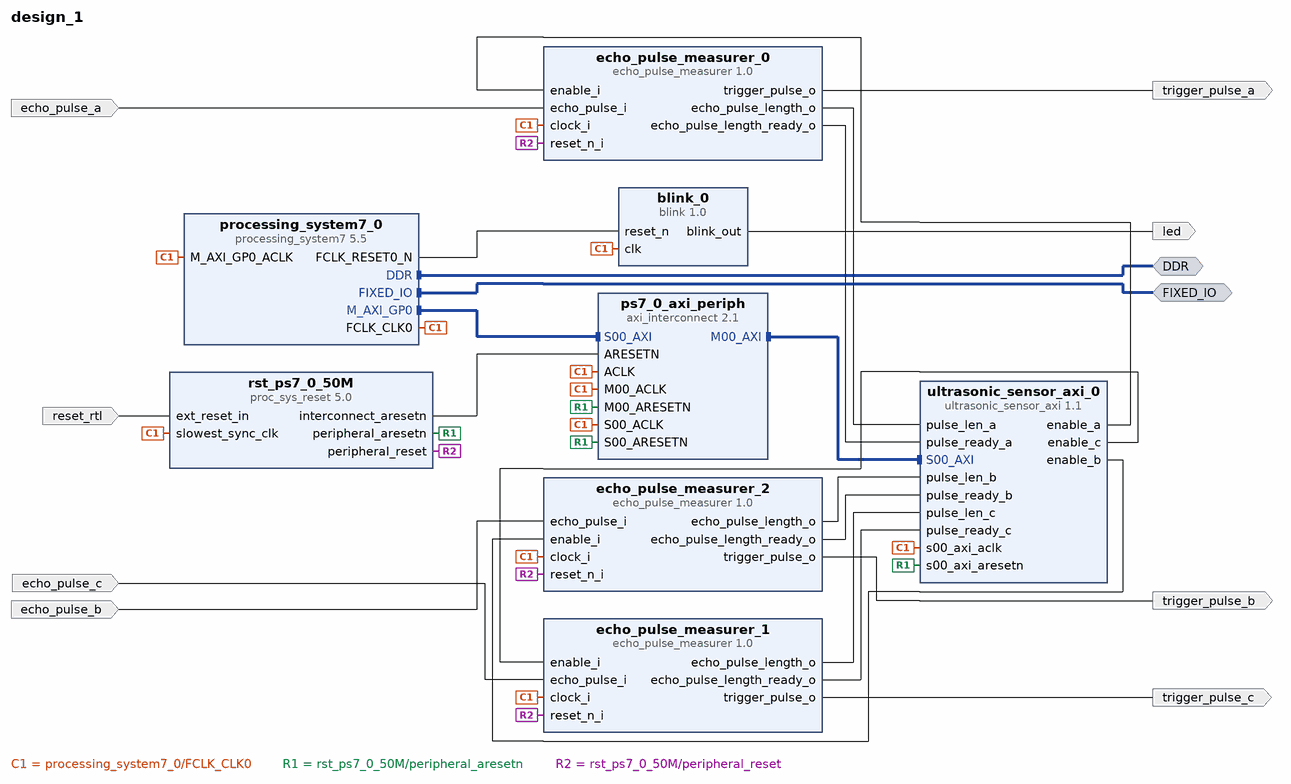
[diagram p0: block diagram of the top level]
# Vivado block design design_1, xc7z010clg400-1, Vivado 2017.2
create_bd_design design_1

create_bd_intf_port -mode Master -vlnv xilinx.com:interface:ddrx_rtl:1.0 DDR
create_bd_intf_port -mode Master -vlnv xilinx.com:display_processing_system7:fixedio_rtl:1.0 FIXED_IO
create_bd_port -dir O led
create_bd_port -dir I echo_pulse_a
create_bd_port -dir O trigger_pulse_a
create_bd_port -dir O trigger_pulse_b
create_bd_port -dir O trigger_pulse_c
create_bd_port -dir I echo_pulse_b
create_bd_port -dir I echo_pulse_c
create_bd_port -dir I -type rst reset_rtl
set_property -dict {CONFIG.POLARITY ACTIVE_LOW} [get_bd_ports reset_rtl]

create_bd_cell -type ip -vlnv xilinx.com:ip:processing_system7:5.5 processing_system7_0
set_property -dict [list \
  CONFIG.PCW_UIPARAM_DDR_FREQ_MHZ 400 \
  CONFIG.PCW_APU_PERIPHERAL_FREQMHZ 667 \
  CONFIG.PCW_QSPI_PERIPHERAL_FREQMHZ 200.000000 \
  CONFIG.PCW_SDIO_PERIPHERAL_FREQMHZ 100 \
  CONFIG.PCW_UART_PERIPHERAL_FREQMHZ 50 \
  CONFIG.PCW_FPGA0_PERIPHERAL_FREQMHZ 50 \
  CONFIG.PCW_FPGA1_PERIPHERAL_FREQMHZ 10 \
  CONFIG.PCW_FPGA2_PERIPHERAL_FREQMHZ 10 \
  CONFIG.PCW_FPGA3_PERIPHERAL_FREQMHZ 10 \
  CONFIG.PCW_PRESET_BANK0_VOLTAGE {LVCMOS 1.8V} \
  CONFIG.PCW_PRESET_BANK1_VOLTAGE {LVCMOS 1.8V} \
  CONFIG.PCW_UIPARAM_DDR_MEMORY_TYPE {LPDDR 2} \
  CONFIG.PCW_UIPARAM_DDR_PARTNO Custom \
  CONFIG.PCW_QSPI_PERIPHERAL_ENABLE 1 \
  CONFIG.PCW_QSPI_GRP_SINGLE_SS_ENABLE 1 \
  CONFIG.PCW_QSPI_GRP_SINGLE_SS_IO {MIO 1 .. 6} \
  CONFIG.PCW_QSPI_GRP_FBCLK_ENABLE 1 \
  CONFIG.PCW_SD0_PERIPHERAL_ENABLE 1 \
  CONFIG.PCW_SD0_SD0_IO {MIO 40 .. 45} \
  CONFIG.PCW_SD1_PERIPHERAL_ENABLE 1 \
  CONFIG.PCW_SD1_SD1_IO {MIO 10 .. 15} \
  CONFIG.PCW_UART0_PERIPHERAL_ENABLE 1 \
  CONFIG.PCW_UART0_UART0_IO {MIO 50 .. 51} \
  CONFIG.PCW_SPI1_PERIPHERAL_ENABLE 1 \
  CONFIG.PCW_SPI1_SPI1_IO {MIO 46 .. 51} \
  CONFIG.PCW_USB_RESET_ENABLE 1 \
  CONFIG.PCW_I2C_RESET_ENABLE 1 \
  CONFIG.PCW_GPIO_PERIPHERAL_ENABLE 1 \
  CONFIG.PCW_GPIO_MIO_GPIO_ENABLE 1 \
  CONFIG.PCW_GPIO_MIO_GPIO_IO MIO \
  CONFIG.PCW_GPIO_EMIO_GPIO_ENABLE 1 \
  CONFIG.PCW_GPIO_EMIO_GPIO_IO 64 \
] [get_bd_cells processing_system7_0]
# 156 more settings of processing_system7_0 are not shown: defaults, MIO pin electricals, DDR timing, and values the tool derives
create_bd_cell -type ip -vlnv craftdrones:user:blink:1.0 blink_0
set_property -dict {CONFIG.max_count 50000000} [get_bd_cells blink_0]
create_bd_cell -type ip -vlnv rit.edu:user:ultrasonic_sensor_axi:1.1 ultrasonic_sensor_axi_0
create_bd_cell -type ip -vlnv xilinx.com:ip:axi_interconnect:2.1 ps7_0_axi_periph
set_property -dict {CONFIG.NUM_MI 1} [get_bd_cells ps7_0_axi_periph]
create_bd_cell -type ip -vlnv xilinx.com:ip:proc_sys_reset:5.0 rst_ps7_0_50M
create_bd_cell -type ip -vlnv rit.edu:user:echo_pulse_measurer:1.0 echo_pulse_measurer_0
create_bd_cell -type ip -vlnv rit.edu:user:echo_pulse_measurer:1.0 echo_pulse_measurer_1
create_bd_cell -type ip -vlnv rit.edu:user:echo_pulse_measurer:1.0 echo_pulse_measurer_2

# ---- connections ----

connect_bd_intf_net [get_bd_intf_pins processing_system7_0/M_AXI_GP0] [get_bd_intf_pins ps7_0_axi_periph/S00_AXI]
connect_bd_intf_net [get_bd_intf_pins ps7_0_axi_periph/M00_AXI] [get_bd_intf_pins ultrasonic_sensor_axi_0/S00_AXI]
connect_bd_intf_net [get_bd_intf_ports DDR] [get_bd_intf_pins processing_system7_0/DDR]
connect_bd_intf_net [get_bd_intf_ports FIXED_IO] [get_bd_intf_pins processing_system7_0/FIXED_IO]
connect_bd_net [get_bd_pins processing_system7_0/FCLK_CLK0] \
  [get_bd_pins processing_system7_0/M_AXI_GP0_ACLK] [get_bd_pins blink_0/clk] [get_bd_pins rst_ps7_0_50M/slowest_sync_clk] \
  [get_bd_pins ultrasonic_sensor_axi_0/s00_axi_aclk] [get_bd_pins ps7_0_axi_periph/S00_ACLK] \
  [get_bd_pins ps7_0_axi_periph/M00_ACLK] [get_bd_pins ps7_0_axi_periph/ACLK] [get_bd_pins echo_pulse_measurer_0/clock_i] \
  [get_bd_pins echo_pulse_measurer_2/clock_i] [get_bd_pins echo_pulse_measurer_1/clock_i]
connect_bd_net [get_bd_pins blink_0/blink_out] [get_bd_ports led]
connect_bd_net [get_bd_pins rst_ps7_0_50M/peripheral_aresetn] \
  [get_bd_pins ultrasonic_sensor_axi_0/s00_axi_aresetn] [get_bd_pins ps7_0_axi_periph/S00_ARESETN] \
  [get_bd_pins ps7_0_axi_periph/M00_ARESETN]
connect_bd_net [get_bd_pins rst_ps7_0_50M/interconnect_aresetn] [get_bd_pins ps7_0_axi_periph/ARESETN]
connect_bd_net [get_bd_pins ultrasonic_sensor_axi_0/enable_a] [get_bd_pins echo_pulse_measurer_0/enable_i]
connect_bd_net [get_bd_pins ultrasonic_sensor_axi_0/enable_b] [get_bd_pins echo_pulse_measurer_2/enable_i]
connect_bd_net [get_bd_pins ultrasonic_sensor_axi_0/enable_c] [get_bd_pins echo_pulse_measurer_1/enable_i]
connect_bd_net [get_bd_pins echo_pulse_measurer_0/echo_pulse_length_o] [get_bd_pins ultrasonic_sensor_axi_0/pulse_len_a]
connect_bd_net [get_bd_pins echo_pulse_measurer_2/echo_pulse_length_o] [get_bd_pins ultrasonic_sensor_axi_0/pulse_len_b]
connect_bd_net [get_bd_pins echo_pulse_measurer_1/echo_pulse_length_o] [get_bd_pins ultrasonic_sensor_axi_0/pulse_len_c]
connect_bd_net [get_bd_pins echo_pulse_measurer_0/echo_pulse_length_ready_o] [get_bd_pins ultrasonic_sensor_axi_0/pulse_ready_a]
connect_bd_net [get_bd_pins echo_pulse_measurer_2/echo_pulse_length_ready_o] [get_bd_pins ultrasonic_sensor_axi_0/pulse_ready_b]
connect_bd_net [get_bd_pins echo_pulse_measurer_1/echo_pulse_length_ready_o] [get_bd_pins ultrasonic_sensor_axi_0/pulse_ready_c]
connect_bd_net [get_bd_pins echo_pulse_measurer_0/trigger_pulse_o] [get_bd_ports trigger_pulse_a]
connect_bd_net [get_bd_pins echo_pulse_measurer_2/trigger_pulse_o] [get_bd_ports trigger_pulse_b]
connect_bd_net [get_bd_pins echo_pulse_measurer_1/trigger_pulse_o] [get_bd_ports trigger_pulse_c]
connect_bd_net [get_bd_ports echo_pulse_a] [get_bd_pins echo_pulse_measurer_0/echo_pulse_i]
connect_bd_net [get_bd_ports echo_pulse_b] [get_bd_pins echo_pulse_measurer_2/echo_pulse_i]
connect_bd_net [get_bd_ports echo_pulse_c] [get_bd_pins echo_pulse_measurer_1/echo_pulse_i]
connect_bd_net [get_bd_ports reset_rtl] [get_bd_pins rst_ps7_0_50M/ext_reset_in]
connect_bd_net [get_bd_pins processing_system7_0/FCLK_RESET0_N] [get_bd_pins blink_0/reset_n]
connect_bd_net [get_bd_pins rst_ps7_0_50M/peripheral_reset] \
  [get_bd_pins echo_pulse_measurer_0/reset_n_i] [get_bd_pins echo_pulse_measurer_1/reset_n_i] \
  [get_bd_pins echo_pulse_measurer_2/reset_n_i]

# ---- address map ----
assign_bd_address -offset 0x43C00000 -range 64K -target_address_space [get_bd_addr_spaces processing_system7_0/Data] [get_bd_addr_segs ultrasonic_sensor_axi_0/S00_AXI/S00_AXI_reg]

validate_bd_design
save_bd_design
